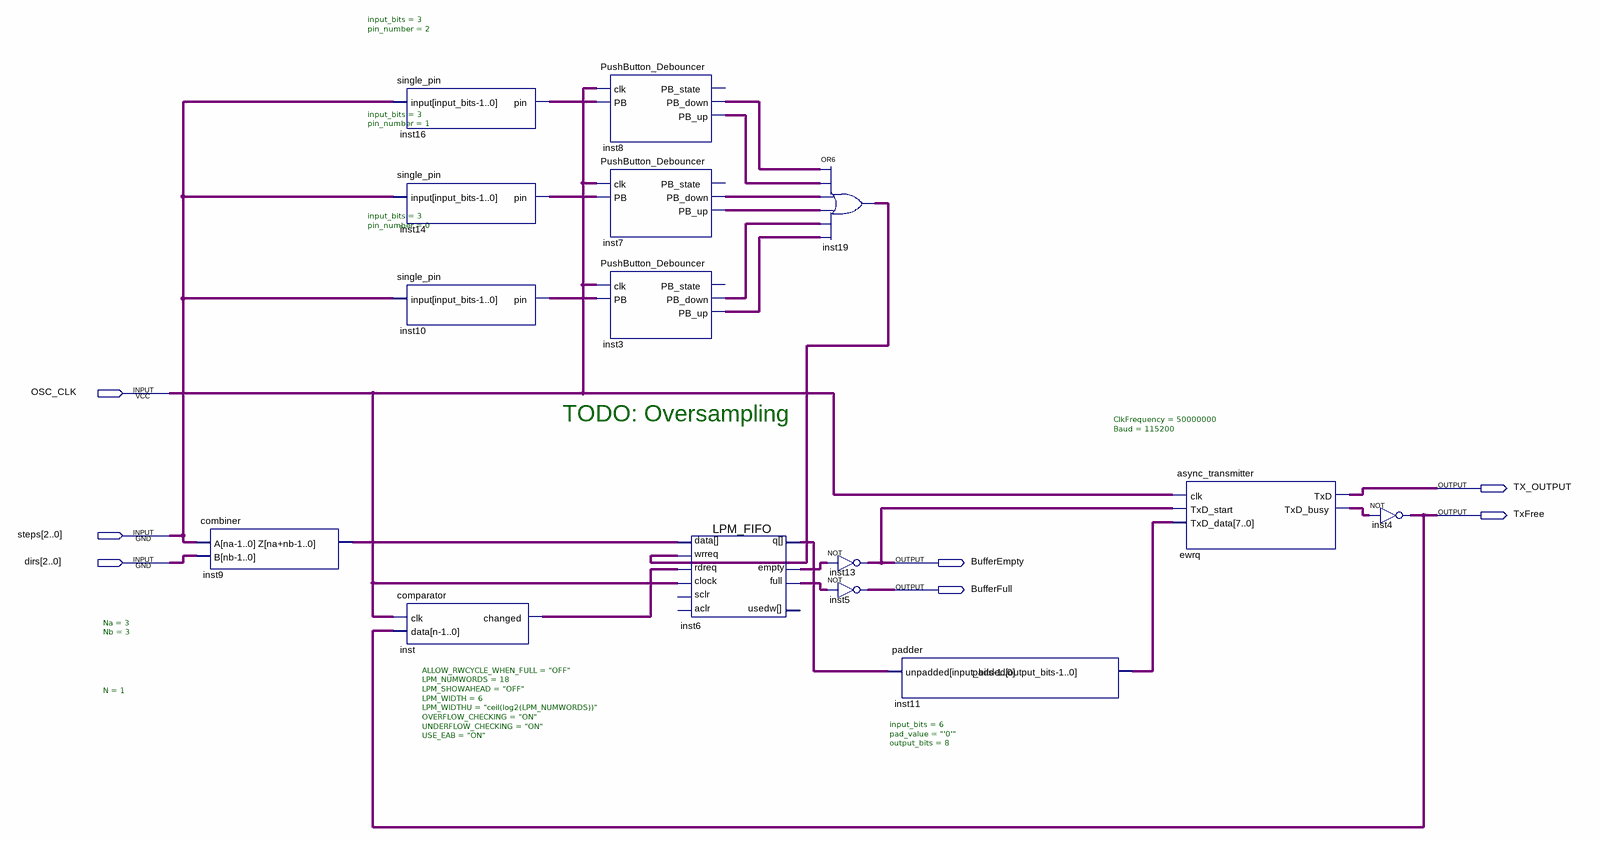
[diagram p0: schematic sheet]
// Quartus schematic simple.bdf as structural Verilog: 15 symbols, 7 pins
module simple (
  input  OSC_CLK,
  input  [2:0] steps,
  input  [2:0] dirs,
  output TX_OUTPUT,
  output TxFree,
  output BufferEmpty,
  output BufferFull
);

  wire ewrq_txd_busy, inst3_pb_down, inst3_pb_up, inst6_empty, inst6_full, inst7_pb_down, inst7_pb_up,
       inst8_pb_down, inst8_pb_up, inst10_pin, inst14_pin, inst16_pin, inst19_out, inst_changed;
  wire [5:0] inst6_q, inst9_z;
  wire [7:0] inst11_padded;

  combiner #(.Na(3), .Nb(3)) inst9 (.A(steps), .B(dirs), .Z(inst9_z));
  single_pin #(.input_bits(3), .pin_number(2)) inst16 (.\input (steps), .pin(inst16_pin));
  single_pin #(.input_bits(3), .pin_number(1)) inst14 (.\input (steps), .pin(inst14_pin));
  single_pin #(.input_bits(3), .pin_number(0)) inst10 (.\input (steps), .pin(inst10_pin));
  comparator #(.N(1)) inst (.clk(OSC_CLK), .data(TxFree), .changed(inst_changed));
  PushButton_Debouncer inst8 (
    .clk(OSC_CLK), .PB(inst16_pin), .PB_down(inst8_pb_down), .PB_up(inst8_pb_up));  // open: PB_state
  PushButton_Debouncer inst7 (
    .clk(OSC_CLK), .PB(inst14_pin), .PB_down(inst7_pb_down), .PB_up(inst7_pb_up));  // open: PB_state
  PushButton_Debouncer inst3 (
    .clk(OSC_CLK), .PB(inst10_pin), .PB_down(inst3_pb_down), .PB_up(inst3_pb_up));  // open: PB_state
  LPM_FIFO #(.ALLOW_RWCYCLE_WHEN_FULL("OFF"), .LPM_NUMWORDS(18), .LPM_SHOWAHEAD("OFF"), .LPM_WIDTH(6), .LPM_WIDTHU("ceil(log2(LPM_NUMWORDS))"), .OVERFLOW_CHECKING("ON"), .UNDERFLOW_CHECKING("ON"), .USE_EAB("ON")) inst6 (
    .clock(OSC_CLK), .data(inst9_z), .wrreq(inst19_out), .rdreq(inst_changed), .q(inst6_q),
    .empty(inst6_empty), .full(inst6_full));  // open: aclr, sclr, usedw
  or inst19 (inst19_out, inst8_pb_down, inst8_pb_up, inst7_pb_down, inst7_pb_up, inst3_pb_down, inst3_pb_up);
  not inst13 (BufferEmpty, inst6_empty);
  not inst5 (BufferFull, inst6_full);
  padder #(.input_bits(6), .pad_value("'0'"), .output_bits(8)) inst11 (.unpadded(inst6_q), .padded(inst11_padded));
  async_transmitter #(.ClkFrequency(50000000), .Baud(115200)) ewrq (
    .clk(OSC_CLK), .TxD_start(BufferEmpty), .TxD_data(inst11_padded), .TxD(TX_OUTPUT),
    .TxD_busy(ewrq_txd_busy));
  not inst4 (TxFree, ewrq_txd_busy);

  // Notes on the sheet:
  //   TODO: Oversampling
endmodule
